# EAGLE schematic BeagleCap2 (EAGLE 6.4)
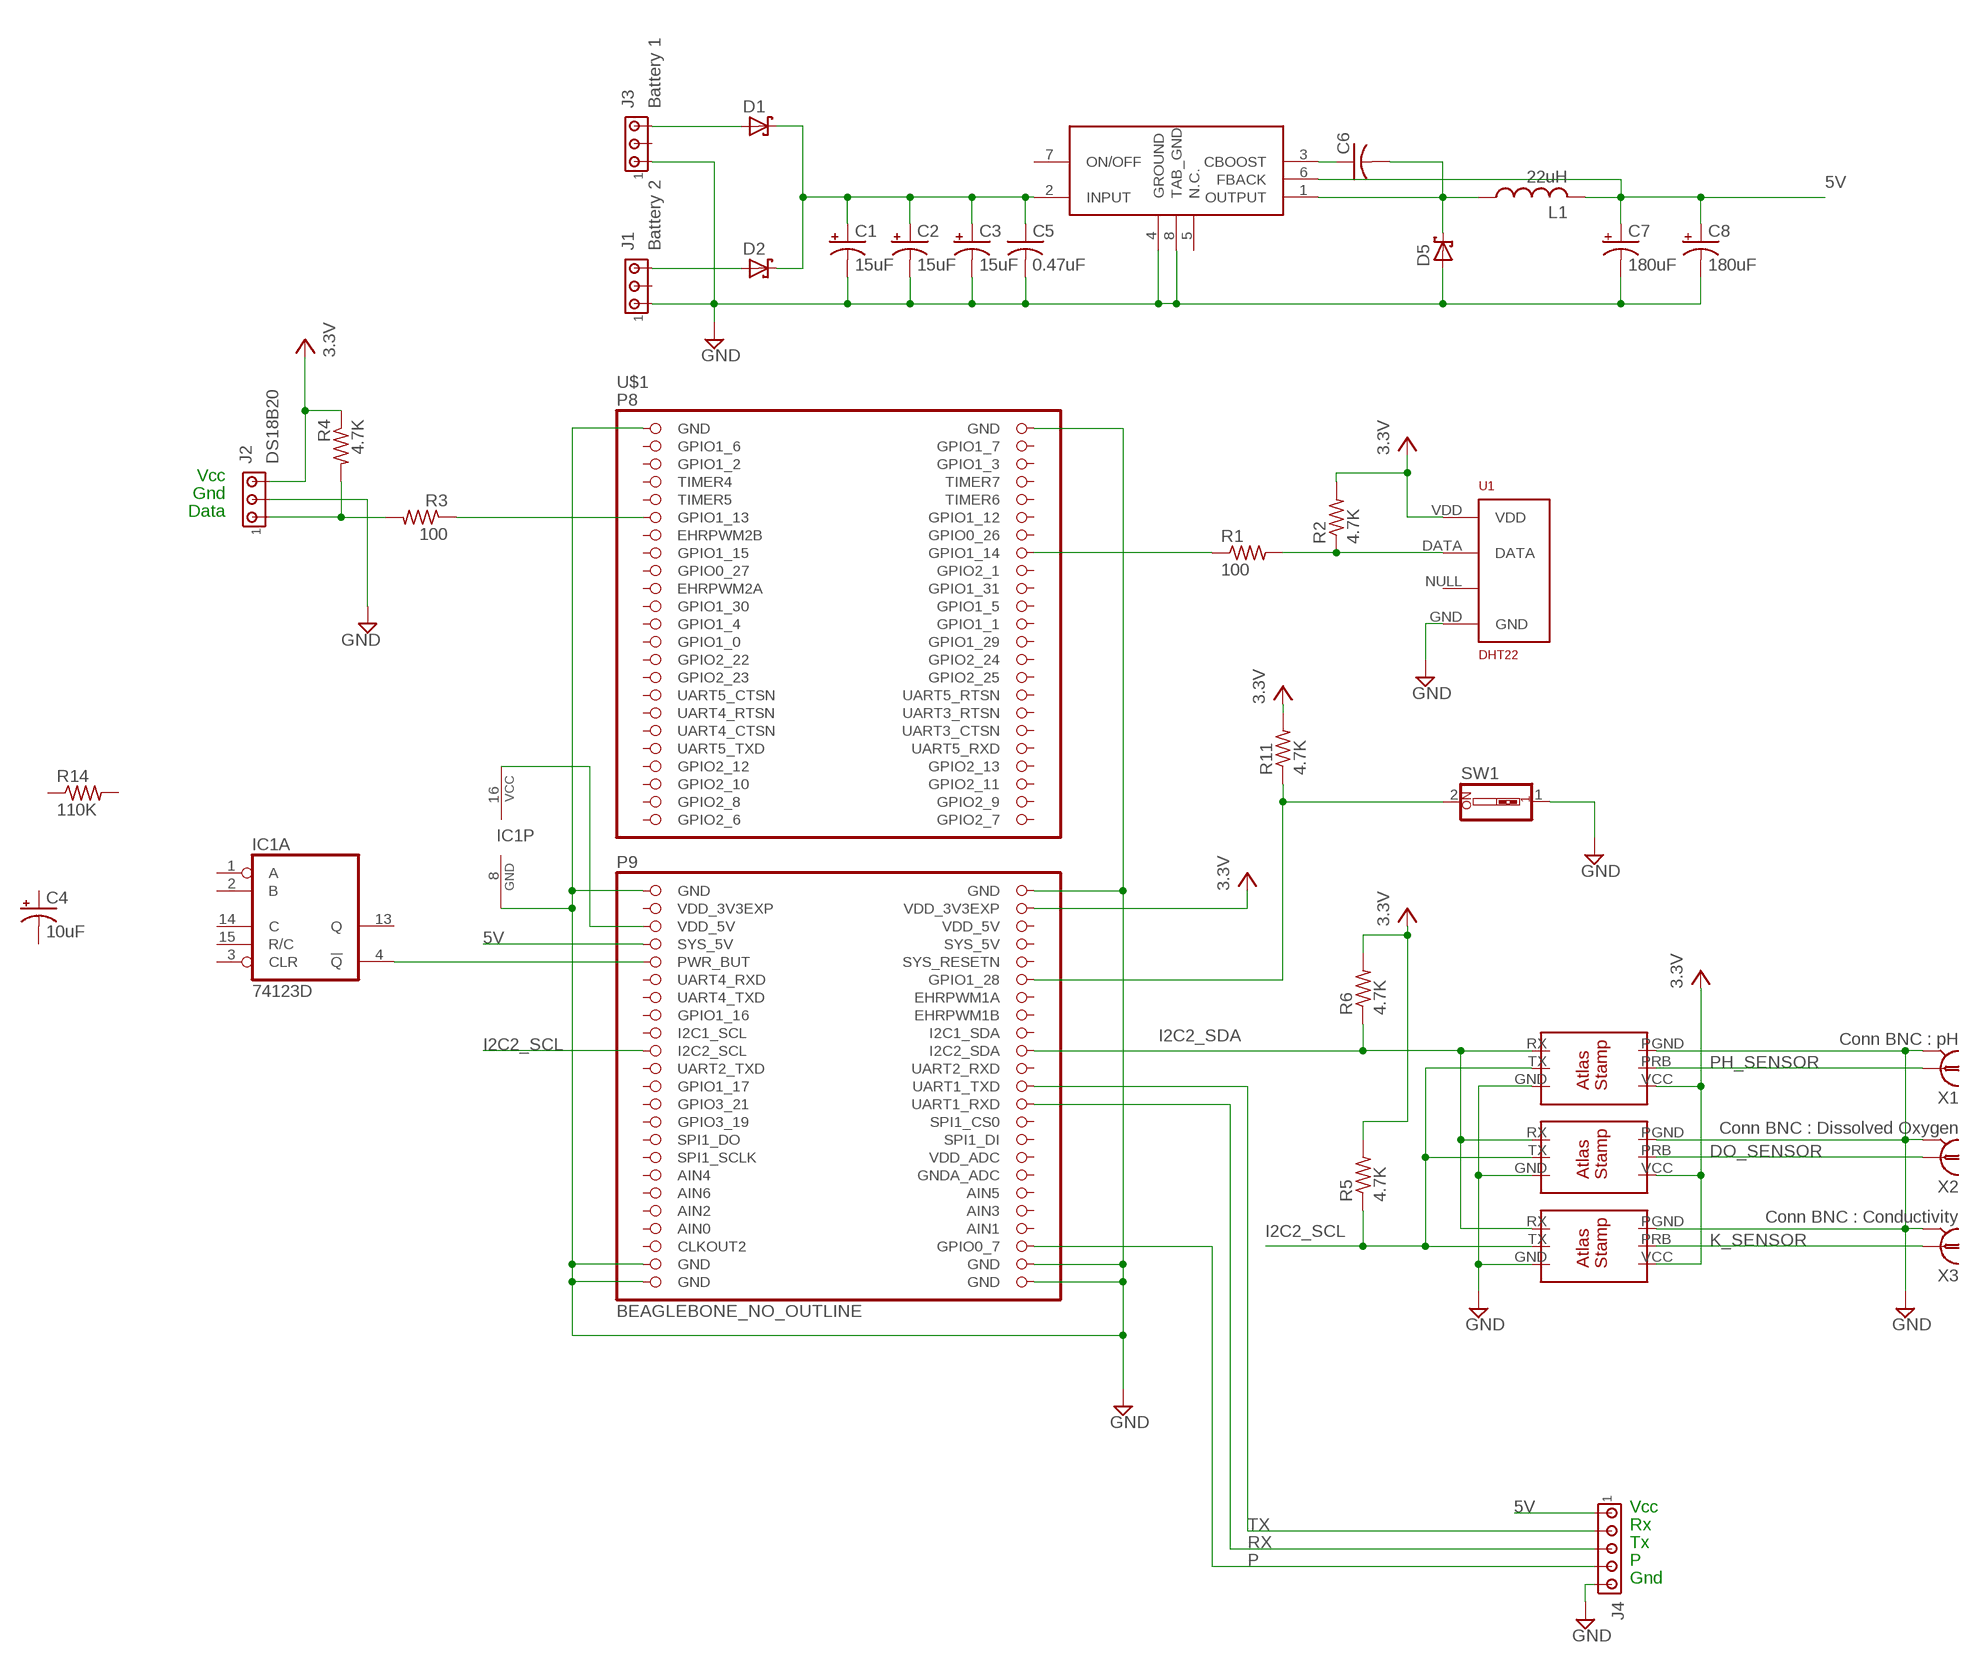
[diagram p0: schematic, sheet 1]

## Parts
C1  15uF  CPOL-US153CLV-0405  [153CLV-0405]
C2  15uF  CPOL-US153CLV-0405  [153CLV-0405]
C3  15uF  CPOL-US153CLV-0405  [153CLV-0405]
C4  10uF  CPOL-USE2-5  [E2-5]
C5  0.47uF  C-US025-025X050  [C025-025X050]
C6  C-US025-025X050  [C025-025X050]
C7  180uF  CPOL-USE2.5-7  [E2,5-7]
C8  180uF  CPOL-USE2.5-7  [E2,5-7]
D1  SCHOTTKY-DIODECB417-15  [CB417-15]
D2  SCHOTTKY-DIODECB417-15  [CB417-15]
D5  SCHOTTKY-DIODEDO41-7  [DO41-7]
IC1  74123D  [SO16]
J1  Battery 2  MTA03-100  [10X03MTA]
J2  DS18B20  MTA03-100  [10X03MTA]
J3  Battery 1  MTA03-100  [10X03MTA]
J4  MTA05-100  [10X05MTA]
L1  22uH  L-US0204/7  [0204/7]
R1  100  R-US_R0805  [R0805]
R2  4.7K  R-US_R0805  [R0805]
R3  100  R-US_R0805  [R0805]
R4  4.7K  R-US_R0805  [R0805]
R5  4.7K  R-US_R0805  [R0805]
R6  4.7K  R-US_R0805  [R0805]
R11  4.7K  R-US_R0805  [R0805]
R14  110K  R-US_R0805  [R0805]
SW1  SW_DIP-1  [EDG-01]
U1  DHT22  RHT03_DHT-22_AM2302WIRED  [AM2302]
U$1  BEAGLEBONE_NO_OUTLINE  [BEAGLEBONE_SHIELD_NO_OUTLINE]
U$2  ATLAS_STAMP  [ATLAS_STAMP]
U$3  ATLAS_STAMP  [ATLAS_STAMP]
U$4  ATLAS_STAMP  [ATLAS_STAMP]
U$6  LM2678KTW0007B  [TO-PMOD7]  (not placed on a sheet)
U$7  LM2678KTW0007B  [TO-PMOD7]
X1  Conn BNC : pH  1-227161-0  [AMP_227161]
X2  Conn BNC : Dissolved Oxygen  1-227161-0  [AMP_227161]
X3  Conn BNC : Conductivity  1-227161-0  [AMP_227161]

## Nets
3.3V: J2.3 R2.2 R4.1 R5.2 R6.2 U1.VDD U$1.50(VDD_3V3EXP) U$2.VCC U$3.VCC U$4.VCC
5V: C7.+ C8.+ IC1.16(P:VCC) J4.1 L1.2 U$1.51(VDD_5V) U$1.53(SYS_5V) U$7.6(FBACK)
DO_SENSOR: U$3.PRB X2.1
GND: C1.- C2.- C3.- C5.2 C7.- C8.- D5.A IC1.8(P:GND) J1.1 J2.2 J3.1 J4.5 SW1.1 U1.GND U$1.1(GND) U$1.2(GND) U$1.47(GND) U$1.48(GND) U$1.89(GND) U$1.90(GND) U$1.91(GND) U$1.92(GND) U$2.GND U$2.PGND U$3.GND U$3.PGND U$4.GND U$4.PGND U$7.4(GROUND) U$7.8(TAB_GND) X1.2 X2.2 X3.2
I2C2_SCL: R5.1 U$1.65(I2C2_SCL) U$2.TX U$3.TX U$4.TX
I2C2_SDA: R6.1 U$1.66(I2C2_SDA) U$2.RX U$3.RX U$4.RX
K_SENSOR: U$4.PRB X3.1
N$1: D2.A J1.3
N$2: D1.A J3.3
N$3: R1.2 R2.1 U1.DATA
N$4: R3.1 U$1.11(GPIO1_13)
N$5: J2.1 R3.2 R4.2
N$6: R1.1 U$1.16(GPIO1_14)
N$7: R11.1 SW1.2 U$1.58(GPIO1_28)
N$8: C1.+ C2.+ C3.+ C5.1 D1.C D2.C U$7.2(INPUT)
N$12: C6.1 U$7.3(CBOOST)
N$13: C6.2 D5.C L1.1 U$7.1(OUTPUT)
N$14: IC1.4(A:!Q) U$1.55(PWR_BUT)
P: J4.4 U$1.88(GPIO0_7)
PH_SENSOR: U$2.PRB X1.1
RX: J4.3 U$1.72(UART1_RXD)
TX: J4.2 U$1.70(UART1_TXD)
VCC: R11.2 ; supply symbol labelled 3.3V
Unconnected: C4.+ C4.- IC1.1(A:A) IC1.2(A:B) IC1.3(A:CLR) IC1.5(B:Q) IC1.6(B:C) IC1.7(B:R/C) IC1.9(B:A) IC1.10(B:B) IC1.11(B:CLR) IC1.12(B:!Q) IC1.13(A:Q) IC1.14(A:C) IC1.15(A:R/C) J1.2 J3.2 R14.1 R14.2 U1.NULL U$1.3(GPIO1_6) U$1.4(GPIO1_7) U$1.5(GPIO1_2) U$1.6(GPIO1_3) U$1.7(TIMER4) U$1.8(TIMER7) U$1.9(TIMER5) U$1.10(TIMER6) U$1.12(GPIO1_12) U$1.13(EHRPWM2B) U$1.14(GPIO0_26) U$1.15(GPIO1_15) U$1.17(GPIO0_27) U$1.18(GPIO2_1) U$1.19(EHRPWM2A) U$1.20(GPIO1_31) U$1.21(GPIO1_30) U$1.22(GPIO1_5) U$1.23(GPIO1_4) U$1.24(GPIO1_1) U$1.25(GPIO1_0) U$1.26(GPIO1_29) U$1.27(GPIO2_22) U$1.28(GPIO2_24) U$1.29(GPIO2_23) U$1.30(GPIO2_25) U$1.31(UART5_CTSN) U$1.32(UART5_RTSN) U$1.33(UART4_RTSN) U$1.34(UART3_RTSN) U$1.35(UART4_CTSN) U$1.36(UART3_CTSN) U$1.37(UART5_TXD) U$1.38(UART5_RXD) U$1.39(GPIO2_12) U$1.40(GPIO2_13) U$1.41(GPIO2_10) U$1.42(GPIO2_11) U$1.43(GPIO2_8) U$1.44(GPIO2_9) U$1.45(GPIO2_6) U$1.46(GPIO2_7) U$1.54(SYS_5V) U$1.56(SYS_RESETN) U$1.57(UART4_RXD) U$1.59(UART4_TXD) U$1.60(EHRPWM1A) U$1.61(GPIO1_16) U$1.62(EHRPWM1B) U$1.63(I2C1_SCL) U$1.64(I2C1_SDA) U$1.67(UART2_TXD) U$1.68(UART2_RXD) U$1.69(GPIO1_17) U$1.71(GPIO3_21) U$1.73(GPIO3_19) U$1.74(SPI1_CS0) U$1.75(SPI1_DO) U$1.76(SPI1_DI) U$1.77(SPI1_SCLK) U$1.78(VDD_ADC) U$1.79(AIN4) U$1.80(GNDA_ADC) U$1.81(AIN6) U$1.82(AIN5) U$1.83(AIN2) U$1.84(AIN3) U$1.86(AIN1) U$1.87(CLKOUT2) U$6.1(OUTPUT) U$6.2(INPUT) U$6.3(CBOOST) U$6.4(GROUND) U$6.5(N.C.) U$6.6(FBACK) U$6.7(ON/OFF) U$6.8(TAB_GND) U$7.5(N.C.) U$7.7(ON/OFF)

## Notes on the sheet
- Vcc
- Gnd
- Data
- Vcc
- Rx
- Tx
- P
- Gnd

## Power pins joined to a net without a drawn wire
AIN0: U$1.85(AIN0)
VDD_3V3EXP: U$1.49(VDD_3V3EXP)
VDD_5V: U$1.52(VDD_5V)

## Library data of the parts
C1-C3 C7 C8 = adafruit:CPOL-US: POLARIZED CAPACITOR, American symbol
C4 = rcl:CPOL-US: POLARIZED CAPACITOR, American symbol
C5 C6 = adafruit:C-US: CAPACITOR, American symbol
D1 D2 D5 = adafruit:SCHOTTKY-DIODE: Schottky Diode
IC1 = 74xx-us:74*123: Retriggerable monostable MULTIVIBRATOR
J1-J3 = con-amp:MTA03-100: AMP connector
J4 = con-amp:MTA05-100: AMP connector
L1 = resistor:L-US: INDUCTOR, American symbol
R1-R6 R11 R14 = adafruit:R-US_: RESISTOR, American symbol
SW1 = special:SW_DIP-1: DIP SWITCH
U1 = RHT03_DHT-22_AM2302:RHT03_DHT-22_AM2302: RHT03 / DHT-22 / AM2302 Packages and symbol for the RHT03 / DHT-22 relative humidity and temperature sensor. Note: The AM2302 is a wired version of the DHT-22 which typically requires less clearance and is thus provided as a separate package.; PROD_ID: SEN-10167
U$1 = LEDscape:BEAGLEBONE_NO_OUTLINE: Should match A3 pinout - but not completely tested
U$2-U$4 = LEDscape:ATLAS_STAMP
U$6 U$7 = Aquarius:LM2678: LM2678 SIMPLE SWITCHER® High Efficiency 5A Step-Down Voltage Regulator
X1-X3 = con-coax:?227161*: JACK, RIGHT ANGLE, 50 OHM, PCB, BNC Source: amp_227161.pdf; MF: TYCO ELECTRONICS; MPN: 1-227161; OC_FARNELL: unknown; OC_NEWARK: 33B3200